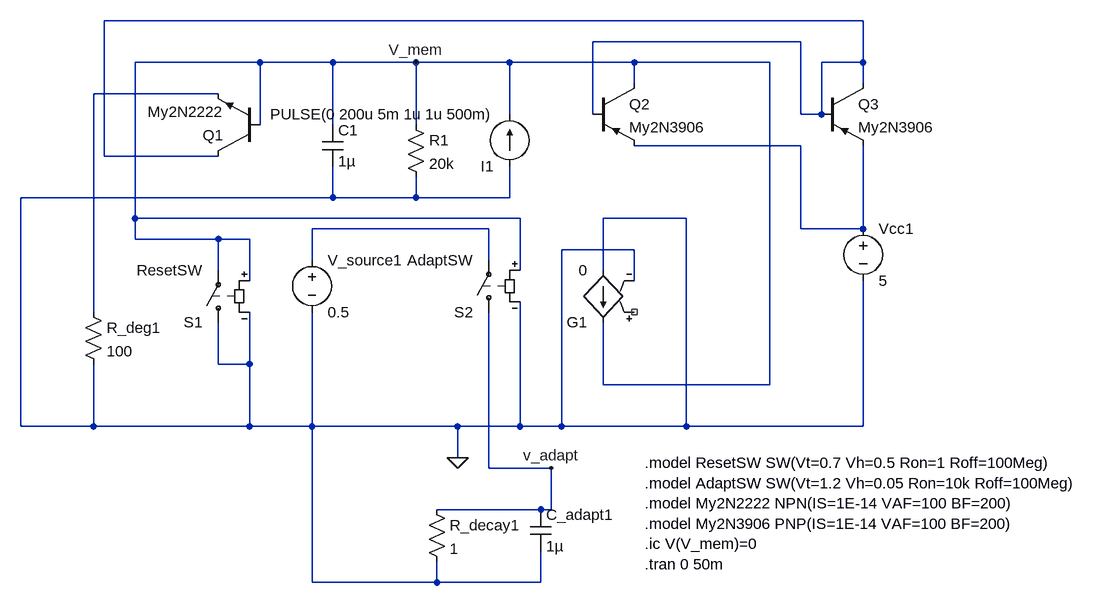
[diagram p0: schematic Alzheimer's.asc]
Alzheimer's.asc, the LTspice schematic file:
Version 4
SHEET 1 984 680
WIRE 592 -320 -576 -320
WIRE 496 -288 176 -288
WIRE -336 -256 -528 -256
WIRE -224 -256 -336 -256
WIRE -96 -256 -224 -256
WIRE 48 -256 -96 -256
WIRE 240 -256 48 -256
WIRE 448 -256 240 -256
WIRE 592 -256 592 -320
WIRE 592 -256 528 -256
WIRE 240 -224 240 -256
WIRE 592 -224 592 -256
WIRE -400 -208 -592 -208
WIRE 48 -176 48 -256
WIRE 176 -176 176 -288
WIRE 496 -176 496 -288
WIRE 528 -176 528 -256
WIRE 528 -176 496 -176
WIRE -336 -160 -336 -256
WIRE -224 -160 -224 -256
WIRE -96 -160 -96 -256
WIRE 496 -128 240 -128
WIRE -576 -112 -576 -320
WIRE -400 -112 -576 -112
WIRE -224 -48 -224 -96
WIRE -224 -48 -704 -48
WIRE -96 -48 -96 -80
WIRE -96 -48 -224 -48
WIRE 48 -48 48 -96
WIRE 48 -48 -96 -48
WIRE -528 -16 -528 -256
WIRE 64 -16 -528 -16
WIRE 320 -16 192 -16
WIRE 16 0 -256 0
WIRE 496 0 496 -128
WIRE 592 0 592 -128
WIRE 592 0 496 0
WIRE -528 16 -528 -16
WIRE -400 16 -528 16
WIRE -352 16 -400 16
WIRE 240 32 128 32
WIRE -256 48 -256 0
WIRE 16 48 16 0
WIRE -400 64 -400 16
WIRE 64 64 64 -16
WIRE 192 64 192 -16
WIRE -352 80 -352 16
WIRE 240 80 240 32
WIRE -592 128 -592 -208
WIRE -400 208 -400 144
WIRE -352 208 -352 128
WIRE -352 208 -400 208
WIRE 192 240 192 144
WIRE 448 240 448 -256
WIRE 448 240 192 240
WIRE -704 304 -704 -48
WIRE -592 304 -592 208
WIRE -592 304 -704 304
WIRE -352 304 -352 208
WIRE -352 304 -592 304
WIRE -256 304 -256 128
WIRE -256 304 -352 304
WIRE -32 304 -256 304
WIRE 64 304 64 112
WIRE 64 304 -32 304
WIRE 128 304 128 32
WIRE 128 304 64 304
WIRE 320 304 320 -16
WIRE 320 304 128 304
WIRE 592 304 592 80
WIRE 592 304 320 304
WIRE -32 352 -32 304
WIRE 16 368 16 128
WIRE 112 368 16 368
WIRE 96 432 -64 432
WIRE 112 432 112 368
WIRE 112 432 96 432
WIRE -256 544 -256 304
WIRE -64 544 -64 512
WIRE -64 544 -256 544
WIRE 96 544 96 496
WIRE 96 544 -64 544
FLAG -96 -256 V_mem
FLAG -32 352 0
FLAG 112 368 v_adapt
SYMBOL cap -240 -160 R0
SYMATTR InstName C1
SYMATTR Value 1µ
SYMBOL cap 80 432 R0
SYMATTR InstName C_adapt1
SYMATTR Value 1µ
SYMBOL res -112 -176 R0
SYMATTR InstName R1
SYMATTR Value 20k
SYMBOL res -608 112 R0
SYMATTR InstName R_deg1
SYMATTR Value 100
SYMBOL res -80 416 R0
SYMATTR InstName R_decay1
SYMATTR Value 1
SYMBOL current 48 -96 R180
WINDOW 123 0 0 Left 0
WINDOW 39 0 0 Left 0
SYMATTR InstName I1
SYMATTR Value PULSE(0 200u 5m 1u 1u 500m)
SYMBOL voltage 592 -16 R0
WINDOW 123 0 0 Left 0
WINDOW 39 0 0 Left 0
SYMATTR InstName Vcc1
SYMATTR Value 5
SYMBOL voltage -256 32 R0
WINDOW 123 0 0 Left 0
WINDOW 39 0 0 Left 0
SYMATTR InstName V_source1
SYMATTR Value 0.5
SYMBOL npn -336 -112 R180
SYMATTR InstName Q1
SYMATTR Value My2N2222
SYMBOL pnp 176 -224 R0
SYMATTR InstName Q2
SYMATTR Value My2N3906
SYMBOL pnp 528 -224 R0
SYMATTR InstName Q3
SYMATTR Value My2N3906
SYMBOL sw -400 160 R180
SYMATTR InstName S1
SYMATTR Value ResetSW
SYMBOL sw 16 144 R180
SYMATTR InstName S2
SYMATTR Value AdaptSW
SYMBOL g 192 160 R180
SYMATTR InstName G1
SYMATTR Value 0
TEXT 256 360 Left 2 !.model ResetSW SW(Vt=0.7 Vh=0.5 Ron=1 Roff=100Meg)\n.model AdaptSW SW(Vt=1.2 Vh=0.05 Ron=10k Roff=100Meg)\n.model My2N2222 NPN(IS=1E-14 VAF=100 BF=200)\n.model My2N3906 PNP(IS=1E-14 VAF=100 BF=200)\n.ic V(V_mem)=0\n.tran 0 50m

The netlist it stands for:
* Alzheimer's.asc
C1 V_mem 0 1µ
C_adapt1 v_adapt 0 1µ
R1 V_mem 0 20k
R_deg1 N002 0 100
R_decay1 v_adapt 0 1
I1 0 V_mem PULSE(0 200u 5m 1u 1u 500m)
Vcc1 N003 0 5
V_source1 N004 0 0.5
Q1 N001 V_mem N002 0 My2N2222
Q2 V_mem N001 N003 0 My2N3906
Q3 N001 N001 N003 0 My2N3906
S1 0 V_mem V_mem 0 ResetSW
S2 v_adapt N004 V_mem 0 AdaptSW
G1 0 V_mem NC_01 0 0
.model NPN NPN
.model PNP PNP
.lib standard.bjt
.model ResetSW SW(Vt=0.7 Vh=0.5 Ron=1 Roff=100Meg)
.model AdaptSW SW(Vt=1.2 Vh=0.05 Ron=10k Roff=100Meg)
.model My2N2222 NPN(IS=1E-14 VAF=100 BF=200)
.model My2N3906 PNP(IS=1E-14 VAF=100 BF=200)
.ic V(V_mem)=0
.tran 0 50m
.backanno
.end